# EAGLE design v2 (EAGLE 9.1.1)
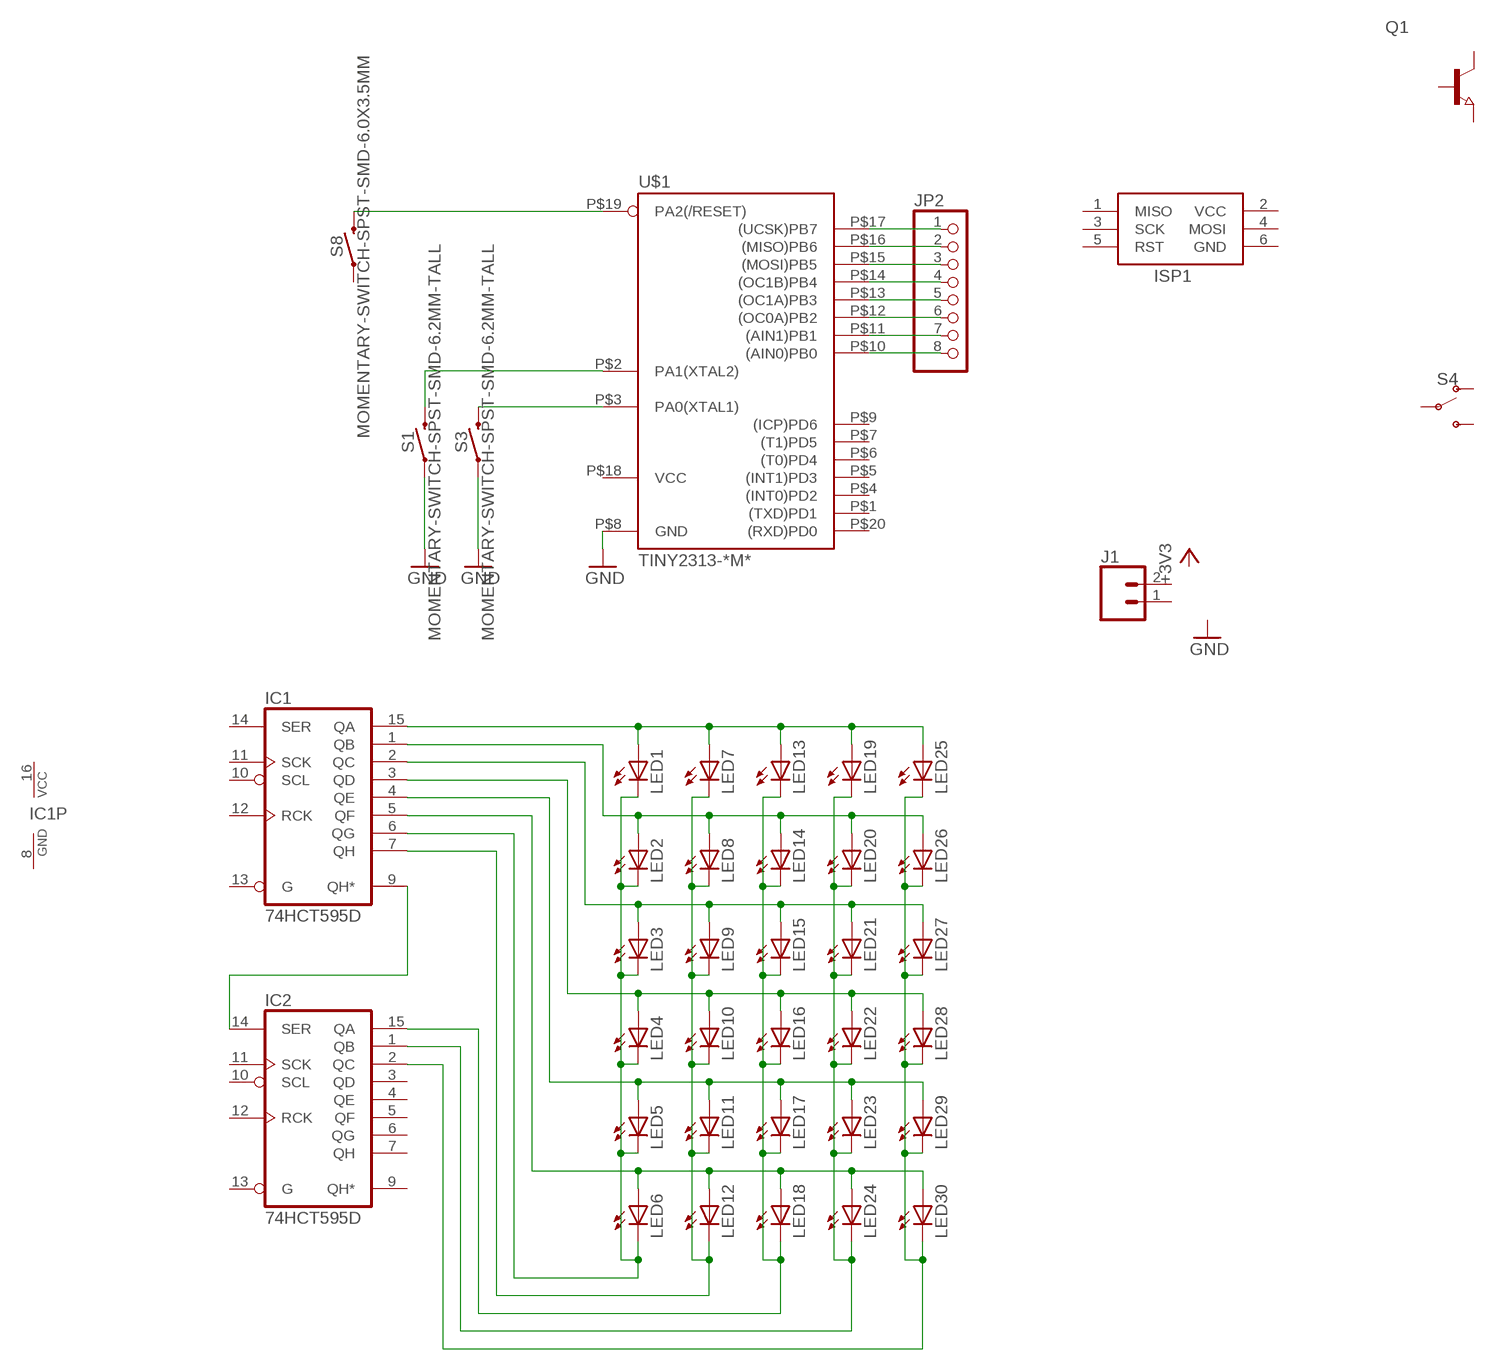
[diagram p0: schematic, sheet 1]

## Parts
IC1  74HCT595D  [SO16]
IC2  74HCT595D  [SO16]
ISP1  AVRISP-6  [AVRISP]
J1  CONN_02  [1X02]
JP2  PINHD-1X8BIG  [1X08-BIG]
LED1  LEDCHIPLED_1206  [CHIPLED_1206]
LED2  LEDCHIPLED_1206  [CHIPLED_1206]
LED3  LEDCHIPLED_1206  [CHIPLED_1206]
LED4  LEDCHIPLED_1206  [CHIPLED_1206]
LED5  LEDCHIPLED_1206  [CHIPLED_1206]
LED6  LEDCHIPLED_1206  [CHIPLED_1206]
LED7  LEDCHIPLED_1206  [CHIPLED_1206]
LED8  LEDCHIPLED_1206  [CHIPLED_1206]
LED9  LEDCHIPLED_1206  [CHIPLED_1206]
LED10  LEDCHIPLED_1206  [CHIPLED_1206]
LED11  LEDCHIPLED_1206  [CHIPLED_1206]
LED12  LEDCHIPLED_1206  [CHIPLED_1206]
LED13  LEDCHIPLED_1206  [CHIPLED_1206]
LED14  LEDCHIPLED_1206  [CHIPLED_1206]
LED15  LEDCHIPLED_1206  [CHIPLED_1206]
LED16  LEDCHIPLED_1206  [CHIPLED_1206]
LED17  LEDCHIPLED_1206  [CHIPLED_1206]
LED18  LEDCHIPLED_1206  [CHIPLED_1206]
LED19  LEDCHIPLED_1206  [CHIPLED_1206]
LED20  LEDCHIPLED_1206  [CHIPLED_1206]
LED21  LEDCHIPLED_1206  [CHIPLED_1206]
LED22  LEDCHIPLED_1206  [CHIPLED_1206]
LED23  LEDCHIPLED_1206  [CHIPLED_1206]
LED24  LEDCHIPLED_1206  [CHIPLED_1206]
LED25  LEDCHIPLED_1206  [CHIPLED_1206]
LED26  LEDCHIPLED_1206  [CHIPLED_1206]
LED27  LEDCHIPLED_1206  [CHIPLED_1206]
LED28  LEDCHIPLED_1206  [CHIPLED_1206]
LED29  LEDCHIPLED_1206  [CHIPLED_1206]
LED30  LEDCHIPLED_1206  [CHIPLED_1206]
Q1  NPN-TRANSISTOR_SOT23  [SOT23]
S1  MOMENTARY-SWITCH-SPST-SMD-6.2MM-TALL  [TACTILE_SWITCH_SMD_6.2MM_TALL]
S3  MOMENTARY-SWITCH-SPST-SMD-6.2MM-TALL  [TACTILE_SWITCH_SMD_6.2MM_TALL]
S4  SWITCH-SPDT-SMD-RIGHT-ANGLE  [SWITCH_SPST_SMD_A]
S8  MOMENTARY-SWITCH-SPST-SMD-6.0X3.5MM  [TACTILE_SWITCH_SMD_6.0X3.5MM]
U$1  TINY2313-*M*  [MLF20]

## Nets
GND: S1.A2 S3.A2 U$1.P$8(GND)
N$1: JP2.1 U$1.P$17((UCSK)PB7)
N$2: JP2.2 U$1.P$16((MISO)PB6)
N$3: JP2.3 U$1.P$15((MOSI)PB5)
N$4: JP2.4 U$1.P$14((OC1B)PB4)
N$5: JP2.5 U$1.P$13((OC1A)PB3)
N$6: JP2.6 U$1.P$12((OC0A)PB2)
N$7: JP2.7 U$1.P$11((AIN1)PB1)
N$8: JP2.8 U$1.P$10((AIN0)PB0)
N$9: IC1.15(QA) LED1.A LED7.A LED13.A LED19.A LED25.A
N$10: IC1.1(QB) LED2.A LED8.A LED14.A LED20.A LED26.A
N$11: IC1.2(QC) LED3.A LED9.A LED15.A LED21.A LED27.A
N$12: IC1.3(QD) LED4.A LED10.A LED16.A LED22.A LED28.A
N$13: IC1.4(QE) LED5.A LED11.A LED17.A LED23.A LED29.A
N$14: IC1.5(QF) LED6.A LED12.A LED18.A LED24.A LED30.A
N$15: IC1.9(QH*) IC2.14(SER)
N$16: IC1.6(QG) LED1.C LED2.C LED3.C LED4.C LED5.C LED6.C
N$17: IC1.7(QH) LED7.C LED8.C LED9.C LED10.C LED11.C LED12.C
N$18: IC2.15(QA) LED13.C LED14.C LED15.C LED16.C LED17.C LED18.C
N$19: IC2.1(QB) LED19.C LED20.C LED21.C LED22.C LED23.C LED24.C
N$20: IC2.2(QC) LED25.C LED26.C LED27.C LED28.C LED29.C LED30.C
N$21: S3.B2 U$1.P$3(PA0(XTAL1))
N$22: S1.B2 U$1.P$2(PA1(XTAL2))
N$23: S8.2 U$1.P$19(PA2(/RESET))
Unconnected: IC1.10(SCL) IC1.11(SCK) IC1.12(RCK) IC1.13(G) IC1.14(SER) IC2.3(QD) IC2.4(QE) IC2.5(QF) IC2.6(QG) IC2.7(QH) IC2.9(QH*) IC2.10(SCL) IC2.11(SCK) IC2.12(RCK) IC2.13(G) ISP1.1(MISO) ISP1.3(SCK) ISP1.4(MOSI) ISP1.5(RST) J1.1 J1.2 Q1.1(B) Q1.2(E) Q1.3(C) S4.1(O) S4.2(P) S4.3(S) S8.1 U$1.P$1((TXD)PD1) U$1.P$4((INT0)PD2) U$1.P$5((INT1)PD3) U$1.P$6((T0)PD4) U$1.P$7((T1)PD5) U$1.P$9((ICP)PD6) U$1.P$20((RXD)PD0)

## Power pins joined to a net without a drawn wire
GND: IC1.8(GND) IC2.8(GND) ISP1.6(GND)
VCC: IC1.16(VCC) IC2.16(VCC) ISP1.2(VCC) U$1.P$18(VCC)

## Library data of the parts
IC1 IC2 = 74xx-eu:74*595: 8-bit SHIFT REGISTER, output latch
ISP1 = adafruit:AVRISP: AVR ISP HEADER Standard 6 pin header for AVR programming
J1 = SparkFun-Connectors:CONN_02: Multi connection point. Often used as Generic Header-pin footprint for 0.1 inch spaced/style header connections On any of the 0.1 inch spaced packages, you can populate with these: Break Away Headers - Straight <https://www.sparkfun.com/products/116> (PRT-00116) Break Away Male Headers - Right Angle <https://www.sparkfun.com/products/553> (PRT-00553) Female Headers <https://www.sparkfun.com/products/115> (PRT-00115) Break Away Headers - Machine Pin <https://www.sparkfun.com/products/117> (PRT-00117) Break Away Female Headers - Swiss Machine Pin <https://www.sparkfun.com/products/743> (PRT-00743) For SCREWTERMINALS and SPRING TERMINALS visit here: Screw Terimnals on SparkFun.com <https://www.sparkfun.com/search/results?term=Screw+Terminals> (5mm/3.5mm/2.54mm spacing) This device is also useful as a general connection point to wire up your design to another part of your project. Our various solder wires solder well into these plated through hole pads. Hook-Up Wire - Assortment (Stranded, 22 AWG) <https://www.sparkfun.com/products/11375> (PRT-11375) Hook-Up Wire - Assortment (Solid Core, 22 AWG) <https://www.sparkfun.com/products/11367> (PRT-11367) View the entire wire category on our website here <https://www.sparkfun.com/categories/141> Special notes: Molex polarized connector foot print use with: PRT-08233 with associated crimp pins and housings. 2.54_SCREWTERM for use with PRT-10571. 3.5mm Screw Terminal footprints for PRT-08084 5mm Screw Terminal footprints for use with PRT-08432
JP2 = adafruit:PINHD-1X8: PIN HEADER
LED1-LED30 = Rheyd:LED: LED OSRAM: - CHIPLED LG R971, LG N971, LY N971, LG Q971, LY Q971, LO R971, LY R971 LH N974, LH R974 LS Q976, LO Q976, LY Q976 LO Q996 - Hyper CHIPLED LW Q18S LB Q993, LB Q99A, LB R99A - SideLED LS A670, LO A670, LY A670, LG A670, LP A670 LB A673, LV A673, LT A673, LW A673 LH A674 LY A675 LS A676, LA A676, LO A676, LY A676, LW A676 LS A679, LY A679, LG A679 - Hyper Micro SIDELED® LS Y876, LA Y876, LO Y876, LY Y876 LT Y87S - SmartLED LW L88C, LW L88S LB L89C, LB L89S, LG L890 LS L89K, LO L89K, LY L89K LS L896, LA L896, LO L896, LY L896 - TOPLED LS T670, LO T670, LY T670, LG T670, LP T670 LSG T670, LSP T670, LSY T670, LOP T670, LYG T670 LG T671, LOG T671, LSG T671 LB T673, LV T673, LT T673, LW T673 LH T674 LS T676, LA T676, LO T676, LY T676, LB T676, LH T676, LSB T676, LW T676 LB T67C, LV T67C, LT T67C, LS T67K, LO T67K, LY T67K, LW E67C LS E67B, LA E67B, LO E67B, LY E67B, LB E67C, LV E67C, LT E67C LW T67C LS T679, LY T679, LG T679 LS T770, LO T770, LY T770, LG T770, LP T770 LB T773, LV T773, LT T773, LW T773 LH T774 LS E675, LA E675, LY E675, LS T675 LS T776, LA T776, LO T776, LY T776, LB T776 LHGB T686 LT T68C, LB T68C - Hyper Mini TOPLED® LB M676 - Mini TOPLED Santana® LG M470 LS M47K, LO M47K, LY M47K Source: http://www.osram.convergy.de LUXEON: - LUMILED® LXK2-PW12-R00, LXK2-PW12-S00, LXK2-PW14-U00, LXK2-PW14-V00 LXK2-PM12-R00, LXK2-PM12-S00, LXK2-PM14-U00 LXK2-PE12-Q00, LXK2-PE12-R00, LXK2-PE12-S00, LXK2-PE14-T00, LXK2-PE14-U00 LXK2-PB12-K00, LXK2-PB12-L00, LXK2-PB12-M00, LXK2-PB14-N00, LXK2-PB14-P00, LXK2-PB14-Q00 LXK2-PR12-L00, LXK2-PR12-M00, LXK2-PR14-Q00, LXK2-PR14-R00 LXK2-PD12-Q00, LXK2-PD12-R00, LXK2-PD12-S00 LXK2-PH12-R00, LXK2-PH12-S00 LXK2-PL12-P00, LXK2-PL12-Q00, LXK2-PL12-R00 Source: www.luxeon.com KINGBRIGHT: KA-3528ASYC Source: www.kingbright.com
Q1 = semicon-smd-ipc:NPN-TRANSISTOR_: NPN TRANSISTOR
S1 S3 = SparkFun-Switches:MOMENTARY-SWITCH-SPST: Momentary Switch (Pushbutton) - SPST Normally-open (NO) SPST momentary switches (buttons, pushbuttons). Variants PTH-12MM - 12mm square, through-hole Momentary Pushbutton Switch - 12mm Square <https://www.sparkfun.com/products/9190> (COM-09190) PTH-6.0MM, PTH-6.0MM-KIT - 6.0mm square, through-hole Mini Pushbutton Switch <https://www.sparkfun.com/products/97> (COM-00097) KIT package intended for soldering kit's - only one side of pads' copper is exposed. PTH-RIGHT-ANGLE-KIT - Right-angle, through-hole Right Angle Tactile Button <https://www.sparkfun.com/products/10791> - Used on SparkFun BigTime Watch Kit <https://www.sparkfun.com/products/11734> SMD-12MM - 12mm square, surface-mount Tactile Button - SMD (12mm) <https://www.sparkfun.com/products/12993> (COM-12993) Used on SparkFun PicoBoard <https://www.sparkfun.com/products/11888> SMD-4.5MM - 4.5mm Square Trackball Switch Used on SparkFun Blackberry Trackballer Breakout <https://www.sparkfun.com/products/13169> SMD-4.6MMX2.8MM - 4.60mm x 2.80mm, surface mount Used on SparkFun SAMD21 Mini Breakout <https://www.sparkfun.com/products/13664> SMD-5.2MM, SMD-5.2-REDUNDANT - 5.2mm square, surface-mount Mini Pushbutton Switch - SMD <https://www.sparkfun.com/products/8720> (COM-08720) Used on Arduino Pro Mini <https://www.sparkfun.com/products/11114> REDUNDANT package connects both switch circuits together SMD-6.0X3.5MM - 6.0 x 3.5mm, surface mount Momentary Reset Switch SMD <https://www.sparkfun.com/products/8229> (COM-08229) SMD-6.2MM-TALL - 6.2mm square, surface mount Tactile Button - SMD (6mm) <https://www.sparkfun.com/products/12992> Used on SparkFun Digital Sandbox <https://www.sparkfun.com/products/12651> SMD-RIGHT-ANGLE - Right-angle, surface mount Used on SparkFun Block for Intel® Edison - Arduino <https://www.sparkfun.com/products/13036>; PROD_ID: SWCH-11966; SF_SKU: COM-12992
S4 = SparkFun-Switches:SWITCH-SPDT: Single Pole, Double Throw (SPDT) Switch Single-pole, double-throw (SPDT) switch. Variant Overview SMD-AYZ0202 Surface Mount DPDT Switch <https://www.sparkfun.com/products/597> (COM-00597) Used on e.g. LilyPad Arduino USB - ATmega32U4 Board <https://www.sparkfun.com/products/12049> PTH-11.6X4.0MM SPDT Mini Power Switch <https://www.sparkfun.com/products/102> (COM-00102) Used on e.g. SparkFun Simon Says - Through-Hole Soldering Kit <https://www.sparkfun.com/products/10547> (KIT-10547) PTH-11.6X4.0MM-KIT KIT version of SPDT Mini Power Switch - Simplifies soldering by removing tStop of switch pins - only one side can be soldered. PTH-11.6X4.0MM-LOCK LOCK version of SPDT Mini Power Switch - Offset pins hold switch in place for easier soldering. SMD-RIGHT-ANGLE Surface Mount Right Angle Switch <https://www.sparkfun.com/products/10860> (COM-10860) Used on e.g. SparkFun ESP8266 Thing <https://www.sparkfun.com/products/13231>; PROD_ID: SWCH-10651; SF_SKU: COM-10860
S8 = SparkFun-Switches:MOMENTARY-SWITCH-SPST: Momentary Switch (Pushbutton) - SPST Normally-open (NO) SPST momentary switches (buttons, pushbuttons). Variants PTH-12MM - 12mm square, through-hole Momentary Pushbutton Switch - 12mm Square <https://www.sparkfun.com/products/9190> (COM-09190) PTH-6.0MM, PTH-6.0MM-KIT - 6.0mm square, through-hole Mini Pushbutton Switch <https://www.sparkfun.com/products/97> (COM-00097) KIT package intended for soldering kit's - only one side of pads' copper is exposed. PTH-RIGHT-ANGLE-KIT - Right-angle, through-hole Right Angle Tactile Button <https://www.sparkfun.com/products/10791> - Used on SparkFun BigTime Watch Kit <https://www.sparkfun.com/products/11734> SMD-12MM - 12mm square, surface-mount Tactile Button - SMD (12mm) <https://www.sparkfun.com/products/12993> (COM-12993) Used on SparkFun PicoBoard <https://www.sparkfun.com/products/11888> SMD-4.5MM - 4.5mm Square Trackball Switch Used on SparkFun Blackberry Trackballer Breakout <https://www.sparkfun.com/products/13169> SMD-4.6MMX2.8MM - 4.60mm x 2.80mm, surface mount Used on SparkFun SAMD21 Mini Breakout <https://www.sparkfun.com/products/13664> SMD-5.2MM, SMD-5.2-REDUNDANT - 5.2mm square, surface-mount Mini Pushbutton Switch - SMD <https://www.sparkfun.com/products/8720> (COM-08720) Used on Arduino Pro Mini <https://www.sparkfun.com/products/11114> REDUNDANT package connects both switch circuits together SMD-6.0X3.5MM - 6.0 x 3.5mm, surface mount Momentary Reset Switch SMD <https://www.sparkfun.com/products/8229> (COM-08229) SMD-6.2MM-TALL - 6.2mm square, surface mount Tactile Button - SMD (6mm) <https://www.sparkfun.com/products/12992> Used on SparkFun Digital Sandbox <https://www.sparkfun.com/products/12651> SMD-RIGHT-ANGLE - Right-angle, surface mount Used on SparkFun Block for Intel® Edison - Arduino <https://www.sparkfun.com/products/13036>; PROD_ID: SWCH-00815; SF_SKU: COM-08229
U$1 = avr-7:TINY2313*: Atmel Tiny2313 2K Flash, 128 bytes EEPROM, 128 bytes RAM

## Board
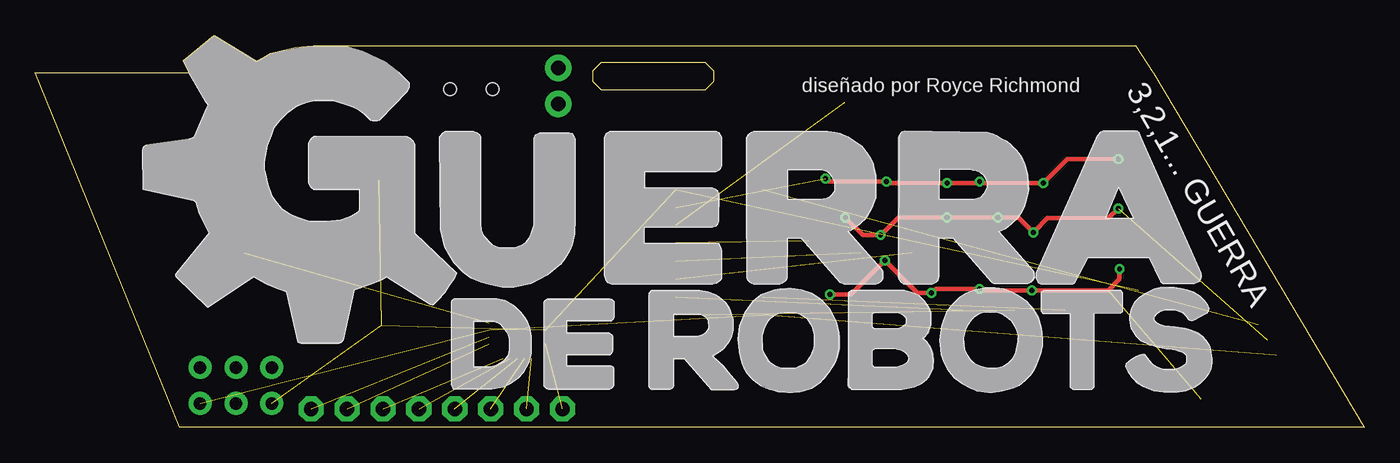
[diagram p1: board, top side]
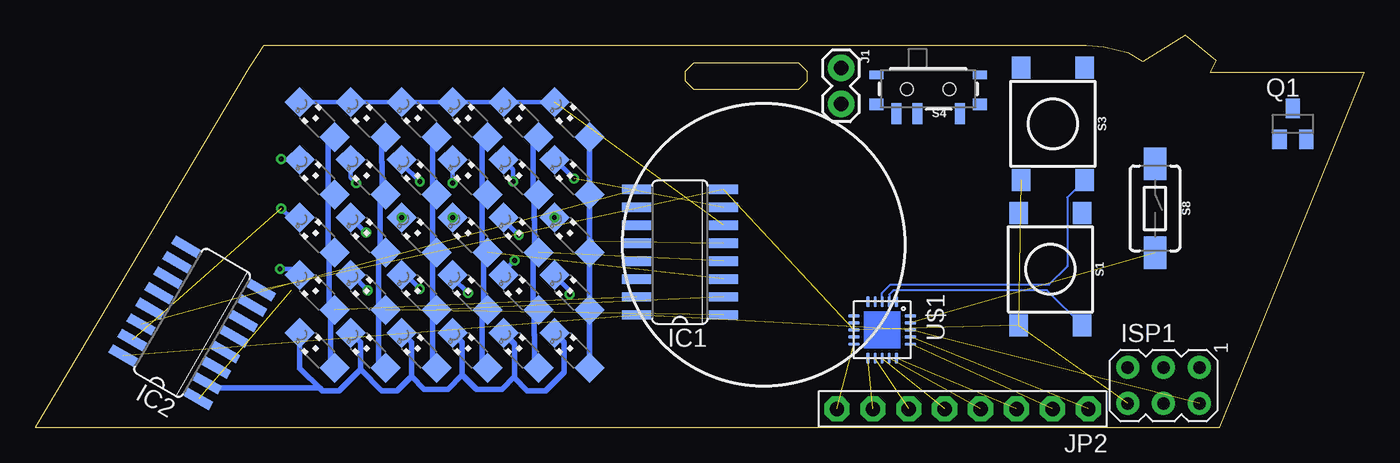
[diagram p2: board, bottom side, seen from below]

Size 94 x 27.75 mm. Coordinates in mm from the lower left corner, seen from the top.
Outline: 79.1,25.1 94,0 10.2,0 0,25.1 10.9,25.1 10.45,25.95 12.65,27.75 15.65,25.9 16.65,26.5 18.4,26.9 19.65,27 20.95,27 77.85,27 79.1,25.1
Outline: 40,23.9 47.4,23.9 48,24.5 48,25.2 47.4,25.8 40,25.8 39.4,25.2 39.4,24.5 40,23.9
Copper layers (1*16): Top 0.0356mm / dielectric 1.5011mm / Bottom 0.0356mm
Design rules "oshpark-2layer *": minimum track width 6mil, minimum drill 13mil, track to track 6mil, track to pad 6mil, pad to pad 6mil, via to via 6mil, smd to smd 6mil, copper to edge 15mil, drill to drill 6mil, minimum pad ring 7mil, minimum via ring 7mil, stop-mask expansion 2.5mil, vias tented up to drill 5000mil, thermal gap 10mil

### Footprints (pad centres in the part's own frame; a part is rotated, then mirrored left to right if it is on the bottom)
SO16 = smd 0.66 x 2.032: 1 -4.445,-3.073; 2 -3.175,-3.073; 3 -1.905,-3.073; 4 -0.635,-3.073; 5 0.635,-3.073; 6 1.905,-3.073; 7 3.175,-3.073; 8 4.445,-3.073; 9 4.445,3.073; 10 3.175,3.073; 11 1.905,3.073; 12 0.635,3.073; 13 -0.635,3.073; 14 -1.905,3.073; 15 -3.175,3.073; 16 -4.445,3.073
AVRISP = drill 0.9 pad 1.626: 1 -1.27,2.54; 2 1.27,2.54; 3 -1.27,0; 4 1.27,0; 5 -1.27,-2.54; 6 1.27,-2.54
1X02 = drill 1.016 pad 1.88: 1 0,0; 2 2.54,0
1X08-BIG = drill 1.016 pad 1.778 octagon: 1 -8.89,0; 2 -6.35,0; 3 -3.81,0; 4 -1.27,0; 5 1.27,0; 6 3.81,0; 7 6.35,0; 8 8.89,0
CHIPLED_1206 = smd 1.5 x 1.5: A 0,-1.75; C 0,1.75
SOT23 = smd 1 x 1.4: 1 -0.95,-1.1; 2 0.95,-1.1; 3 0,1.1
TACTILE_SWITCH_SMD_6.2MM_TALL = smd 1.55 x 1.3: A1 -3.975,-2.25; A2 3.975,-2.25; B1 -3.975,2.25; B2 3.975,2.25
SWITCH_SPST_SMD_A = smd 0.7 x 1.5: 1 -2.25,-1.75; 2 -0.75,-1.75; 3 2.25,-1.75 | smd 1 x 0.6: GND1 -3.65,1; GND3 3.65,1 | smd 1 x 0.8: GND2 -3.65,-1.1; GND4 3.65,-1.1 | hole 0.9: -1.5,0; 1.5,0
TACTILE_SWITCH_SMD_6.0X3.5MM = smd 2.3 x 1.6: 1 -3.15,0; 2 3.15,0
MLF20 = smd 0.8 x 0.23: P$1 -2,1; P$2 -2,0.5; P$3 -2,0; P$4 -2,-0.5; P$5 -2,-1; P$11 2,-1; P$12 2,-0.5; P$13 2,0; P$14 2,0.5; P$15 2,1 | smd 0.23 x 0.8: P$6 -1,-2; P$7 -0.5,-2; P$8 0,-2; P$9 0.5,-2; P$10 1,-2; P$16 1,2; P$17 0.5,2; P$18 0,2; P$19 -0.5,2; P$20 -1,2

### Placement (x,y rotation side)
IC1  48.4,12.4 90 bottom
IC2  82.9,7.4 60 bottom
ISP1  14.19,2.96 270 bottom
J1  37,25.43 270 bottom
JP2  28.4,1.3 180 bottom
LED1  74.05,21.78 45 bottom
LED2  70.45,21.78 45 bottom
LED3  66.85,21.78 45 bottom
LED4  63.25,21.78 45 bottom
LED5  59.65,21.78 45 bottom
LED6  56.05,21.78 45 bottom
LED7  74.05,17.7 45 bottom
LED8  70.45,17.7 45 bottom
LED9  66.85,17.7 45 bottom
LED10  63.25,17.7 45 bottom
LED11  59.65,17.7 45 bottom
LED12  56.05,17.7 45 bottom
LED13  74.05,13.62 45 bottom
LED14  70.45,13.62 45 bottom
LED15  66.85,13.62 45 bottom
LED16  63.25,13.62 45 bottom
LED17  59.65,13.62 45 bottom
LED18  56.05,13.62 45 bottom
LED19  74.05,9.53 45 bottom
LED20  70.45,9.53 45 bottom
LED21  66.85,9.53 45 bottom
LED22  63.25,9.53 45 bottom
LED23  59.65,9.53 45 bottom
LED24  56.05,9.53 45 bottom
LED25  74.05,5.45 45 bottom
LED26  70.45,5.45 45 bottom
LED27  66.85,5.45 45 bottom
LED28  63.25,5.45 45 bottom
LED29  59.65,5.45 45 bottom
LED30  56.05,5.45 45 bottom
Q1  5.04,21.48 0 bottom
S1  22.2,11.19 270 bottom
S3  22.02,21.48 270 bottom
S4  30.84,23.95 0 bottom
S8  14.8,15.5 270 bottom
U$1  34.09,6.89 270 bottom

### Tracks (layer width: path | path; a pad name or v marks a point on that pad's centre or on a via)
GND  (5 unrouted)
N$1  (1 unrouted)
N$2  (1 unrouted)
N$3  (1 unrouted)
N$4  (1 unrouted)
N$5  (1 unrouted)
N$6  (1 unrouted)
N$7  (1 unrouted)
N$8  (1 unrouted)
N$9  (1 unrouted)
  Bottom 0.406: LED25.A 73.1,4.51 73.1,6.84 73.1,8.01 LED19.A 73.2,8.69 73.2,10.2 73.2,12 73.19,12 LED13.A 73.3,12.87 73.3,16.3 72.97,16.3 LED7.A 73.3,16.95 73.3,20.2 73.16,20.2 LED1.A
N$10  (1 unrouted)
  Bottom 0.406: LED26.A 69.7,4.7 69.7,8.4 69.31,8.4 LED20.A 69.7,8.79 69.7,12.3 69.29,12.3 LED14.A 69.6,12.77 69.6,16.1 69.57,16.1 69.49,16.19 | 69.49,16.19 LED8.A | 69.49,16.19 69.49,18.77 69.5,18.79 69.5,20.25 LED2.A
N$11  (1 unrouted)
  Bottom 0.406: LED3.A 65.9,20.25 65.9,18.79 65.9,16.75 LED9.A 65.9,16.17 65.9,14.71 65.9,14.7 65.9,12.67 LED15.A 65.9,12.09 65.9,10.62 65.9,8.59 LED21.A 65.9,8.01 65.9,6.54 65.9,4.5 LED27.A
N$12  (1 unrouted)
  Bottom 0.406: LED28.A 62.4,4.6 62.4,7.91 LED22.A 62.3,8.59 62.3,10.62 62.3,12.09 LED16.A 62.4,12.77 62.4,16.07 LED10.A 62.4,16.85 62.4,20.15 LED4.A
N$13  (1 unrouted)
  Bottom 0.406: LED29.A 58.7,4.5 58.7,6.54 58.7,8.01 LED23.A 58.8,8.69 58.8,11.99 LED17.A 58.7,12.67 58.7,14.7 58.7,14.71 58.7,16.17 LED11.A 58.8,16.85 58.8,20.15 LED5.A
N$14  (1 unrouted)
  Bottom 0.406: LED30.A LED24.A LED18.A | LED18.A 54.81,13.09 | 54.81,13.09 54.7,13.2 54.81,13.09 | 54.81,13.09 LED18.A | LED18.A LED12.A LED6.A
N$15  (1 unrouted)
N$16  (1 unrouted)
  Bottom 0.305: LED1.C LED2.C | LED2.C | LED2.C LED3.C LED4.C LED5.C LED6.C | LED6.C
N$17  (via drill 0.35)  (1 unrouted)
  Top 0.305: v76.6,19 73,19 v71.3,17.3 66.9,17.3 v66.8,17.4 66.7,17.3 v64.5,17.3 60.3,17.3 v60.2,17.4 56.1,17.4 v55.9,17.6
  Bottom 0.305: LED7.C 76.54,18.94 v76.6,19 | v71.3,17.3 71.69,17.69 LED8.C | v66.8,17.4 68.09,18.69 LED9.C | v64.5,17.3 64.5,18.92 LED10.C | v60.2,17.4 60.2,18.25 LED11.C | v55.9,17.6 57.24,18.94 LED12.C
N$18  (via drill 0.35)  (1 unrouted)
  Top 0.305: v76.6,15.5 75.9,14.8 71.6,14.8 70.7,13.9 70.6,13.9 v70.6,13.8 69.55,14.85 LED15.C LED16.C 61.05,14.85 v59.8,13.6 58.54,13.6 LED18.C
  Bottom 0.305: LED13.C 75.95,14.85 v76.6,15.5 | v70.6,13.8 70.63,13.8 LED14.C | v59.8,13.6 60.89,14.69 LED17.C
  other vias: 68.09,14.85 64.49,14.85 57.29,14.85
N$19  (via drill 0.35)  (1 unrouted)
  Top 0.305: v76.7,11.2 76.7,10.5 75.9,9.7 v70.5,9.7 66.9,9.7 v66.8,9.8 63.7,9.8 v63.4,9.5 62.4,9.5 v60.1,11.8 57.7,9.4 v56.2,9.4
  Bottom 0.305: LED19.C 75.71,11.2 v76.7,11.2 | v70.5,9.7 71.57,10.77 LED20.C | v66.8,9.8 67.77,10.77 LED21.C | v63.4,9.5 64.49,10.59 LED22.C | v60.1,11.8 60.89,11.01 LED23.C | v56.2,9.4 56.2,9.69 LED24.C
N$20
  Bottom 0.406: LED25.C 75.29,4.19 73.8,2.7 | 73.8,2.7 73.7,2.6 72.5,2.6 71,4.1 | 71,4.1 71,6 LED26.C | 71,4.1 69.5,2.6 68.4,2.6 67.4,3.6 | LED27.C 67.4,6 67.4,3.6 | 67.4,3.6 66.5,2.7 64.8,2.7 63.8,3.7 | LED28.C 63.8,6 63.8,3.7 | 63.8,3.7 62.8,2.7 61,2.7 60.1,3.6 60.1,3.9 | LED29.C 60.1,5.9 60.1,3.9 | 60.1,3.9 60.1,3.5 59.2,2.6 57.9,2.6 56.6,3.9 56.6,6 LED30.C | IC2.2 81.51,2.8 73.9,2.8 73.8,2.7
N$21
  Bottom 0.152: U$1.P$3 34.09,9.51 33.5,10.1 22.3,10.1 21,11.4 21,16.28 S3.B2
N$22
  Bottom 0.152: S1.B2 22.44,9.7 33.3,9.7 33.59,9.41 U$1.P$2
N$23  (1 unrouted)
VCC  (3 unrouted)

### Text on the board
tPlace: diseñado por Royce Richmond | 3,2,1... GUERRA